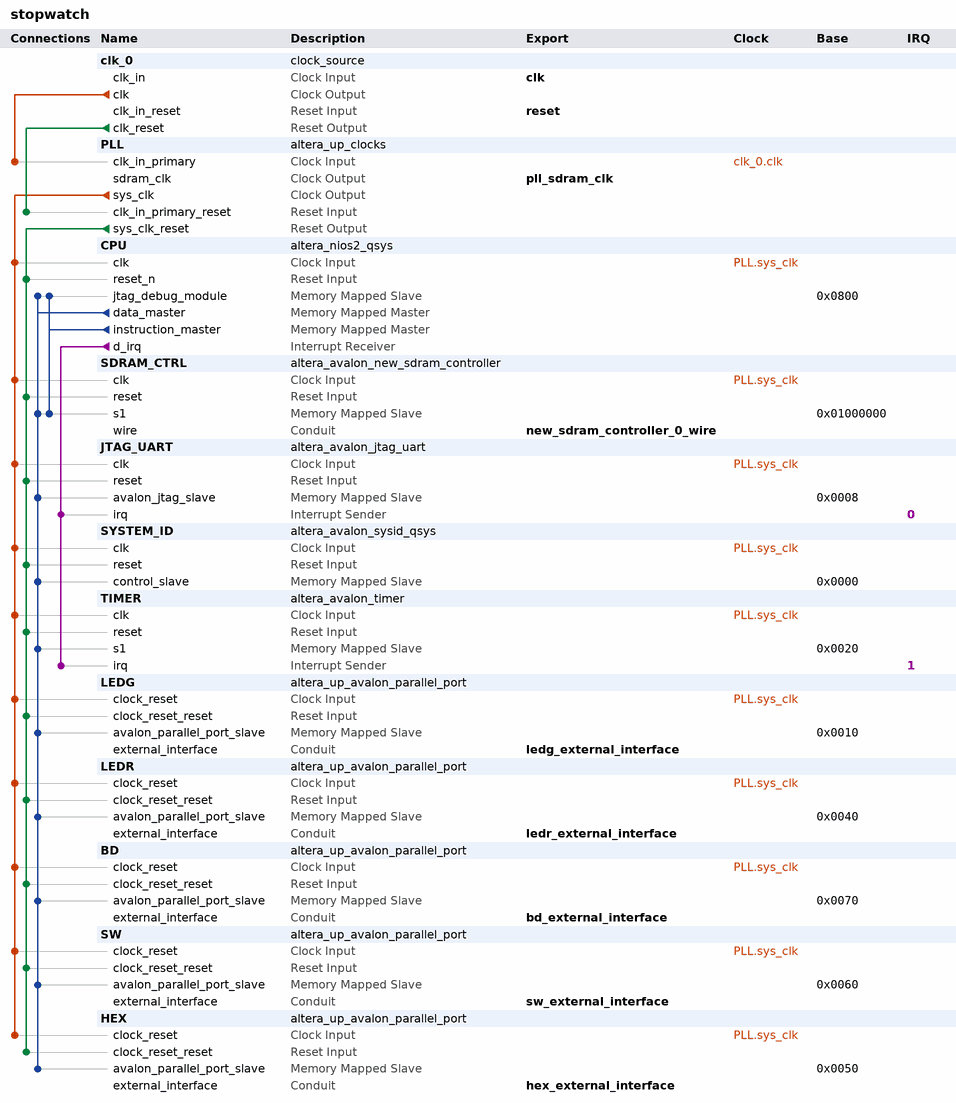
[diagram p0: system contents]
# Platform Designer (Qsys) system stopwatch, Cyclone II EP2C20F484C7
# Parameters at their usual value, and those the tool derives, are not listed.
package require -exact qsys 13.0
create_system stopwatch
set_project_property DEVICE_FAMILY {Cyclone II}
set_project_property DEVICE EP2C20F484C7

add_instance clk_0 clock_source 13.0
set_instance_parameter_value clk_0 clockFrequency 50000000

add_instance PLL altera_up_clocks 13.0
set_instance_parameter_value PLL board DE1
set_instance_parameter_value PLL vga_clk false
set_instance_parameter_value PLL audio_clk false
set_instance_parameter_value PLL audio_clk_freq 12.288

add_instance CPU altera_nios2_qsys 13.0
set_instance_parameter_value CPU resetSlave SDRAM_CTRL.s1
set_instance_parameter_value CPU mmu_TLBMissExcSlave None
set_instance_parameter_value CPU exceptionSlave SDRAM_CTRL.s1
set_instance_parameter_value CPU breakSlave CPU.jtag_debug_module
set_instance_parameter_value CPU impl Tiny
set_instance_parameter_value CPU icache_size 4096

add_instance SDRAM_CTRL altera_avalon_new_sdram_controller 13.0.1.99.2
set_instance_parameter_value SDRAM_CTRL TAC 5.5
set_instance_parameter_value SDRAM_CTRL TRCD 20.0
set_instance_parameter_value SDRAM_CTRL TRP 20.0
set_instance_parameter_value SDRAM_CTRL casLatency 3
set_instance_parameter_value SDRAM_CTRL columnWidth 8
set_instance_parameter_value SDRAM_CTRL dataWidth 16
set_instance_parameter_value SDRAM_CTRL generateSimulationModel false
set_instance_parameter_value SDRAM_CTRL model single_Micron_MT48LC4M32B2_7_chip
set_instance_parameter_value SDRAM_CTRL numberOfBanks 4
set_instance_parameter_value SDRAM_CTRL numberOfChipSelects 1
set_instance_parameter_value SDRAM_CTRL powerUpDelay 100.0
set_instance_parameter_value SDRAM_CTRL refreshPeriod 15.625
set_instance_parameter_value SDRAM_CTRL rowWidth 12

add_instance JTAG_UART altera_avalon_jtag_uart 13.0.1.99.2
set_instance_parameter_value JTAG_UART simInteractiveOptions NO_INTERACTIVE_WINDOWS

add_instance SYSTEM_ID altera_avalon_sysid_qsys 13.0
set_instance_parameter_value SYSTEM_ID id 0

add_instance TIMER altera_avalon_timer 13.0.1.99.2
set_instance_parameter_value TIMER period 1
set_instance_parameter_value TIMER periodUnits MSEC

add_instance LEDG altera_up_avalon_parallel_port 13.0
set_instance_parameter_value LEDG board DE1
set_instance_parameter_value LEDG preset LEDs
set_instance_parameter_value LEDG capture false
set_instance_parameter_value LEDG edge Rising
set_instance_parameter_value LEDG irq false

add_instance LEDR altera_up_avalon_parallel_port 13.0
set_instance_parameter_value LEDR board DE1
set_instance_parameter_value LEDR preset LEDs
set_instance_parameter_value LEDR leds Red
set_instance_parameter_value LEDR capture false
set_instance_parameter_value LEDR edge Rising
set_instance_parameter_value LEDR irq false

add_instance BD altera_up_avalon_parallel_port 13.0
set_instance_parameter_value BD board DE1
set_instance_parameter_value BD preset Pushbuttons
set_instance_parameter_value BD capture false
set_instance_parameter_value BD edge Rising
set_instance_parameter_value BD irq false

add_instance SW altera_up_avalon_parallel_port 13.0
set_instance_parameter_value SW board DE1
set_instance_parameter_value SW preset {Slider Switches}
set_instance_parameter_value SW capture false
set_instance_parameter_value SW edge Rising
set_instance_parameter_value SW irq false

add_instance HEX altera_up_avalon_parallel_port 13.0
set_instance_parameter_value HEX board DE1
set_instance_parameter_value HEX preset {Seven Segment Displays}
set_instance_parameter_value HEX capture false
set_instance_parameter_value HEX edge Rising
set_instance_parameter_value HEX irq false

# connections
add_connection clk_0.clk PLL.clk_in_primary clock
add_connection PLL.sys_clk BD.clock_reset clock
add_connection PLL.sys_clk CPU.clk clock
add_connection PLL.sys_clk HEX.clock_reset clock
add_connection PLL.sys_clk JTAG_UART.clk clock
add_connection PLL.sys_clk LEDG.clock_reset clock
add_connection PLL.sys_clk LEDR.clock_reset clock
add_connection PLL.sys_clk SDRAM_CTRL.clk clock
add_connection PLL.sys_clk SW.clock_reset clock
add_connection PLL.sys_clk SYSTEM_ID.clk clock
add_connection PLL.sys_clk TIMER.clk clock
add_connection clk_0.clk_reset PLL.clk_in_primary_reset reset
add_connection PLL.sys_clk_reset BD.clock_reset_reset reset
add_connection PLL.sys_clk_reset CPU.reset_n reset
add_connection PLL.sys_clk_reset HEX.clock_reset_reset reset
add_connection PLL.sys_clk_reset JTAG_UART.reset reset
add_connection PLL.sys_clk_reset LEDG.clock_reset_reset reset
add_connection PLL.sys_clk_reset LEDR.clock_reset_reset reset
add_connection PLL.sys_clk_reset SDRAM_CTRL.reset reset
add_connection PLL.sys_clk_reset SW.clock_reset_reset reset
add_connection PLL.sys_clk_reset SYSTEM_ID.reset reset
add_connection PLL.sys_clk_reset TIMER.reset reset
add_connection CPU.data_master BD.avalon_parallel_port_slave avalon
set_connection_parameter_value CPU.data_master/BD.avalon_parallel_port_slave baseAddress 0x0070
add_connection CPU.data_master CPU.jtag_debug_module avalon
set_connection_parameter_value CPU.data_master/CPU.jtag_debug_module baseAddress 0x0800
add_connection CPU.data_master HEX.avalon_parallel_port_slave avalon
set_connection_parameter_value CPU.data_master/HEX.avalon_parallel_port_slave baseAddress 0x0050
add_connection CPU.data_master JTAG_UART.avalon_jtag_slave avalon
set_connection_parameter_value CPU.data_master/JTAG_UART.avalon_jtag_slave baseAddress 0x0008
add_connection CPU.data_master LEDG.avalon_parallel_port_slave avalon
set_connection_parameter_value CPU.data_master/LEDG.avalon_parallel_port_slave baseAddress 0x0010
add_connection CPU.data_master LEDR.avalon_parallel_port_slave avalon
set_connection_parameter_value CPU.data_master/LEDR.avalon_parallel_port_slave baseAddress 0x0040
add_connection CPU.data_master SDRAM_CTRL.s1 avalon
set_connection_parameter_value CPU.data_master/SDRAM_CTRL.s1 baseAddress 0x01000000
add_connection CPU.data_master SW.avalon_parallel_port_slave avalon
set_connection_parameter_value CPU.data_master/SW.avalon_parallel_port_slave baseAddress 0x0060
add_connection CPU.data_master SYSTEM_ID.control_slave avalon
set_connection_parameter_value CPU.data_master/SYSTEM_ID.control_slave baseAddress 0x0000
add_connection CPU.data_master TIMER.s1 avalon
set_connection_parameter_value CPU.data_master/TIMER.s1 baseAddress 0x0020
add_connection CPU.instruction_master CPU.jtag_debug_module avalon
set_connection_parameter_value CPU.instruction_master/CPU.jtag_debug_module baseAddress 0x0800
add_connection CPU.instruction_master SDRAM_CTRL.s1 avalon
set_connection_parameter_value CPU.instruction_master/SDRAM_CTRL.s1 baseAddress 0x01000000
add_connection CPU.d_irq JTAG_UART.irq interrupt
set_connection_parameter_value CPU.d_irq/JTAG_UART.irq irqNumber 0
add_connection CPU.d_irq TIMER.irq interrupt
set_connection_parameter_value CPU.d_irq/TIMER.irq irqNumber 1

# exported interfaces
add_interface clk clock sink
set_interface_property clk EXPORT_OF clk_0.clk_in
add_interface reset reset sink
set_interface_property reset EXPORT_OF clk_0.clk_in_reset
add_interface pll_sdram_clk clock source
set_interface_property pll_sdram_clk EXPORT_OF PLL.sdram_clk
add_interface new_sdram_controller_0_wire conduit end
set_interface_property new_sdram_controller_0_wire EXPORT_OF SDRAM_CTRL.wire
add_interface ledg_external_interface conduit end
set_interface_property ledg_external_interface EXPORT_OF LEDG.external_interface
add_interface ledr_external_interface conduit end
set_interface_property ledr_external_interface EXPORT_OF LEDR.external_interface
add_interface bd_external_interface conduit end
set_interface_property bd_external_interface EXPORT_OF BD.external_interface
add_interface sw_external_interface conduit end
set_interface_property sw_external_interface EXPORT_OF SW.external_interface
add_interface hex_external_interface conduit end
set_interface_property hex_external_interface EXPORT_OF HEX.external_interface

set_interconnect_requirement {$system} qsys_mm.clockCrossingAdapter HANDSHAKE
set_interconnect_requirement {$system} qsys_mm.maxAdditionalLatency 1

save_system stopwatch.qsys
